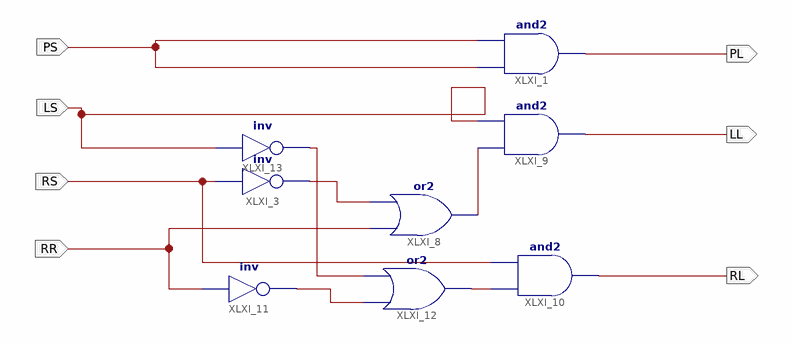
[diagram p0: schematic sheet 1]
// Xilinx ISE schematic C3_11.sch (kintex7) as structural Verilog: 8 symbols, 7 ports
module C3_11 (
  input  LS,
  input  RS,
  input  RR,
  input  PS,
  output PL,
  output LL,
  output RL
);

  wire XLXN_22, XLXN_24, XLXN_30, XLXN_33, XLXN_34;

  not XLXI_3 (XLXN_22, RS);
  and XLXI_1 (PL, PS, PS);
  or XLXI_8 (XLXN_24, RR, XLXN_22);
  and XLXI_9 (LL, XLXN_24, LS);
  and XLXI_10 (RL, XLXN_34, RS);
  not XLXI_11 (XLXN_30, RR);
  or XLXI_12 (XLXN_34, XLXN_30, XLXN_33);
  not XLXI_13 (XLXN_33, LS);
endmodule
